# EAGLE design dual-radio (EAGLE 7.2.0)
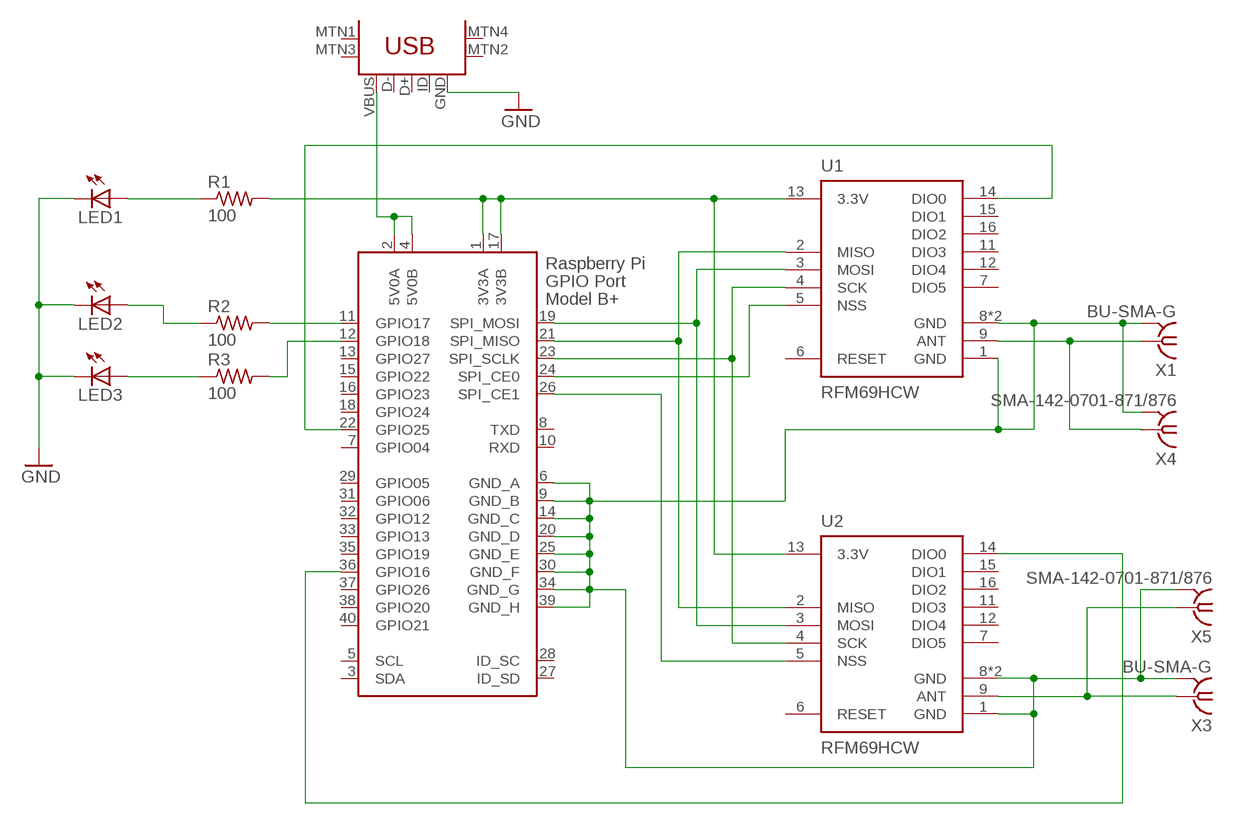
[diagram p0: schematic, sheet 1]

## Parts
LED1  LEDSML0805  [SML0805]
LED2  LEDSML0805  [SML0805]
LED3  LEDSML0805  [SML0805]
R1  100  R-US_M0805  [M0805]
R2  100  R-US_M0805  [M0805]
R3  100  R-US_M0805  [M0805]
U1  RFM69HCW  [RFM69HCW-XXXS2]
U2  RFM69HCW  [RFM69HCW-XXXS2]
U$1  USB-MINIB-5PIN  [USB-MINIB]
X1  BU-SMA-G  [BU-SMA-G]
X2  RASPI_BOARD_B+#_HDC  [RASPI_BOARD_B+HAT_DF_CF]
X3  BU-SMA-G  [BU-SMA-G]
X4  SMA-142-0701-871/876  [J502-ND-142-0701-871/876]
X5  SMA-142-0701-871/876  [J502-ND-142-0701-871/876]

## Nets
GND: LED1.C LED2.C LED3.C U$1.GND
N$1: R1.2 U1.13(3.3V) U2.13(3.3V) X2.1(3V3A) X2.17(3V3B)
N$2: U1.2(MISO) U2.2(MISO) X2.21(SPI_MISO)
N$3: U1.3(MOSI) U2.3(MOSI) X2.19(SPI_MOSI)
N$4: U1.4(SCK) U2.4(SCK) X2.23(SPI_SCLK)
N$5: U1.5(NSS) X2.24(SPI_CE0)
N$6: U2.5(NSS) X2.26(SPI_CE1)
N$7: U1.1(GND) U1.8(GND) U1.10(GND) U2.1(GND) U2.8(GND) U2.10(GND) X1.2 X1.3 X1.4 X1.5 X2.6(GND_A) X2.9(GND_B) X2.14(GND_C) X2.20(GND_D) X2.25(GND_E) X2.30(GND_F) X2.34(GND_G) X2.39(GND_H) X3.2 X3.3 X3.4 X3.5 X4.G@1 X4.G@2 X4.G@3 X4.G@4 X5.G@1 X5.G@2 X5.G@3 X5.G@4
N$8: U1.14(DIO0) X2.22(GPIO25)
N$9: U2.14(DIO0) X2.36(GPIO16)
N$10: U1.9(ANT) X1.1 X4.1
N$11: U2.9(ANT) X3.1 X5.1
N$12: R2.2 X2.11(GPIO17)
N$13: R3.2 X2.12(GPIO18)
N$14: LED1.A R1.1
N$15: LED2.A R2.1
N$16: LED3.A R3.1
N$17: U$1.VBUS X2.2(5V0A) X2.4(5V0B)
Unconnected: U1.6(RESET) U1.7(DIO5) U1.11(DIO3) U1.12(DIO4) U1.15(DIO1) U1.16(DIO2) U2.6(RESET) U2.7(DIO5) U2.11(DIO3) U2.12(DIO4) U2.15(DIO1) U2.16(DIO2) U$1.D+ U$1.D- U$1.ID U$1.MTN1(MTN2) U$1.MTN2(MTN3) U$1.MTN3(MTN1) U$1.MTN4 X2.3(SDA) X2.5(SCL) X2.7(GPIO04) X2.8(TXD) X2.10(RXD) X2.13(GPIO27) X2.15(GPIO22) X2.16(GPIO23) X2.18(GPIO24) X2.27(ID_SD) X2.28(ID_SC) X2.29(GPIO05) X2.31(GPIO06) X2.32(GPIO12) X2.33(GPIO13) X2.35(GPIO19) X2.37(GPIO26) X2.38(GPIO20) X2.40(GPIO21)

## Library data of the parts
LED1-LED3 = led:LED: LED OSRAM: - CHIPLED LG R971, LG N971, LY N971, LG Q971, LY Q971, LO R971, LY R971 LH N974, LH R974 LS Q976, LO Q976, LY Q976 LO Q996 - Hyper CHIPLED LW Q18S LB Q993, LB Q99A, LB R99A - SideLED LS A670, LO A670, LY A670, LG A670, LP A670 LB A673, LV A673, LT A673, LW A673 LH A674 LY A675 LS A676, LA A676, LO A676, LY A676, LW A676 LS A679, LY A679, LG A679 - Hyper Micro SIDELED® LS Y876, LA Y876, LO Y876, LY Y876 LT Y87S - SmartLED LW L88C, LW L88S LB L89C, LB L89S, LG L890 LS L89K, LO L89K, LY L89K LS L896, LA L896, LO L896, LY L896 - TOPLED LS T670, LO T670, LY T670, LG T670, LP T670 LSG T670, LSP T670, LSY T670, LOP T670, LYG T670 LG T671, LOG T671, LSG T671 LB T673, LV T673, LT T673, LW T673 LH T674 LS T676, LA T676, LO T676, LY T676, LB T676, LH T676, LSB T676, LW T676 LB T67C, LV T67C, LT T67C, LS T67K, LO T67K, LY T67K, LW E67C LS E67B, LA E67B, LO E67B, LY E67B, LB E67C, LV E67C, LT E67C LW T67C LS T679, LY T679, LG T679 LS T770, LO T770, LY T770, LG T770, LP T770 LB T773, LV T773, LT T773, LW T773 LH T774 LS E675, LA E675, LY E675, LS T675 LS T776, LA T776, LO T776, LY T776, LB T776 LHGB T686 LT T68C, LB T68C - Hyper Mini TOPLED® LB M676 - Mini TOPLED Santana® LG M470 LS M47K, LO M47K, LY M47K Source: http://www.osram.convergy.de LUXEON: - LUMILED® LXK2-PW12-R00, LXK2-PW12-S00, LXK2-PW14-U00, LXK2-PW14-V00 LXK2-PM12-R00, LXK2-PM12-S00, LXK2-PM14-U00 LXK2-PE12-Q00, LXK2-PE12-R00, LXK2-PE12-S00, LXK2-PE14-T00, LXK2-PE14-U00 LXK2-PB12-K00, LXK2-PB12-L00, LXK2-PB12-M00, LXK2-PB14-N00, LXK2-PB14-P00, LXK2-PB14-Q00 LXK2-PR12-L00, LXK2-PR12-M00, LXK2-PR14-Q00, LXK2-PR14-R00 LXK2-PD12-Q00, LXK2-PD12-R00, LXK2-PD12-S00 LXK2-PH12-R00, LXK2-PH12-S00 LXK2-PL12-P00, LXK2-PL12-Q00, LXK2-PL12-R00 Source: www.luxeon.com KINGBRIGHT: KA-3528ASYC Source: www.kingbright.com
R1-R3 = resistor:R-US_: RESISTOR, American symbol
U1 U2 = SparkFun-RF:RFM69H
U$1 = SparkFun-Connectors:USB-MINIB: Mini-USB "B" connector with 5th pin broken out. Created new symbol breaking out 5th "ID" pin in mini/micro USB connector spec. See: http://en.wikipedia.org/wiki/Mini_usb#Cables. Uses same footprint as 4-pin symbol. Also added pins to connect to mounting / shield pads if required (probably not generally needed as signals aren't shielded once they leave the connector).
X1 X3 = con-coax:BU-SMA-G: FEMALE SMA CONNECTOR Radiall distributor RS 193-9117; OC_FARNELL: unknown; OC_NEWARK: unknown
X2 = raspberrypi_bastelstube_v13:RASPI_BOARD_B+#: Raspberry Pi GPIO connector with markings for the outer dimensions of the Raspberry Pi board model B+ with different sets of drill holes or mounting pads All pins connected
X4 X5 = con-coax:SMA-: SMA 50 Ohm End Launch Jack Receptacle - Round Contact Johnson Components Source: www.johnsoncomponents.com .. J502-ND.pdf; MF: JOHNSON COMPONENTS; MPN: 142-0701-871; OC_FARNELL: 1339835; OC_NEWARK: 91B6105

## Board
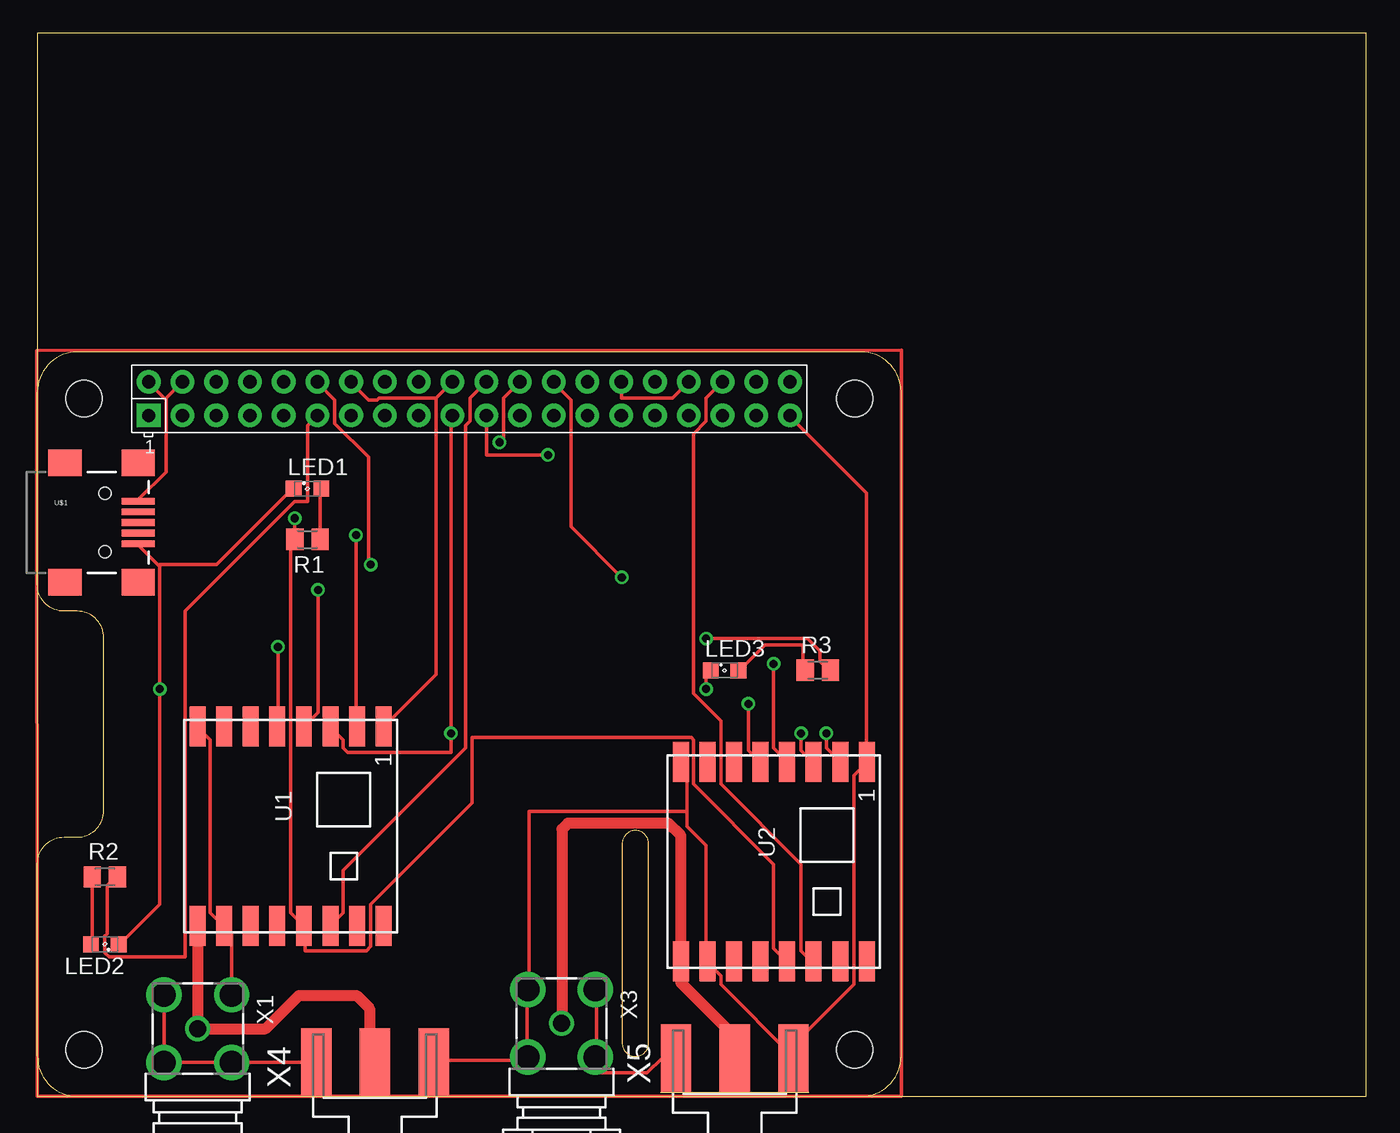
[diagram p1: board, top side]
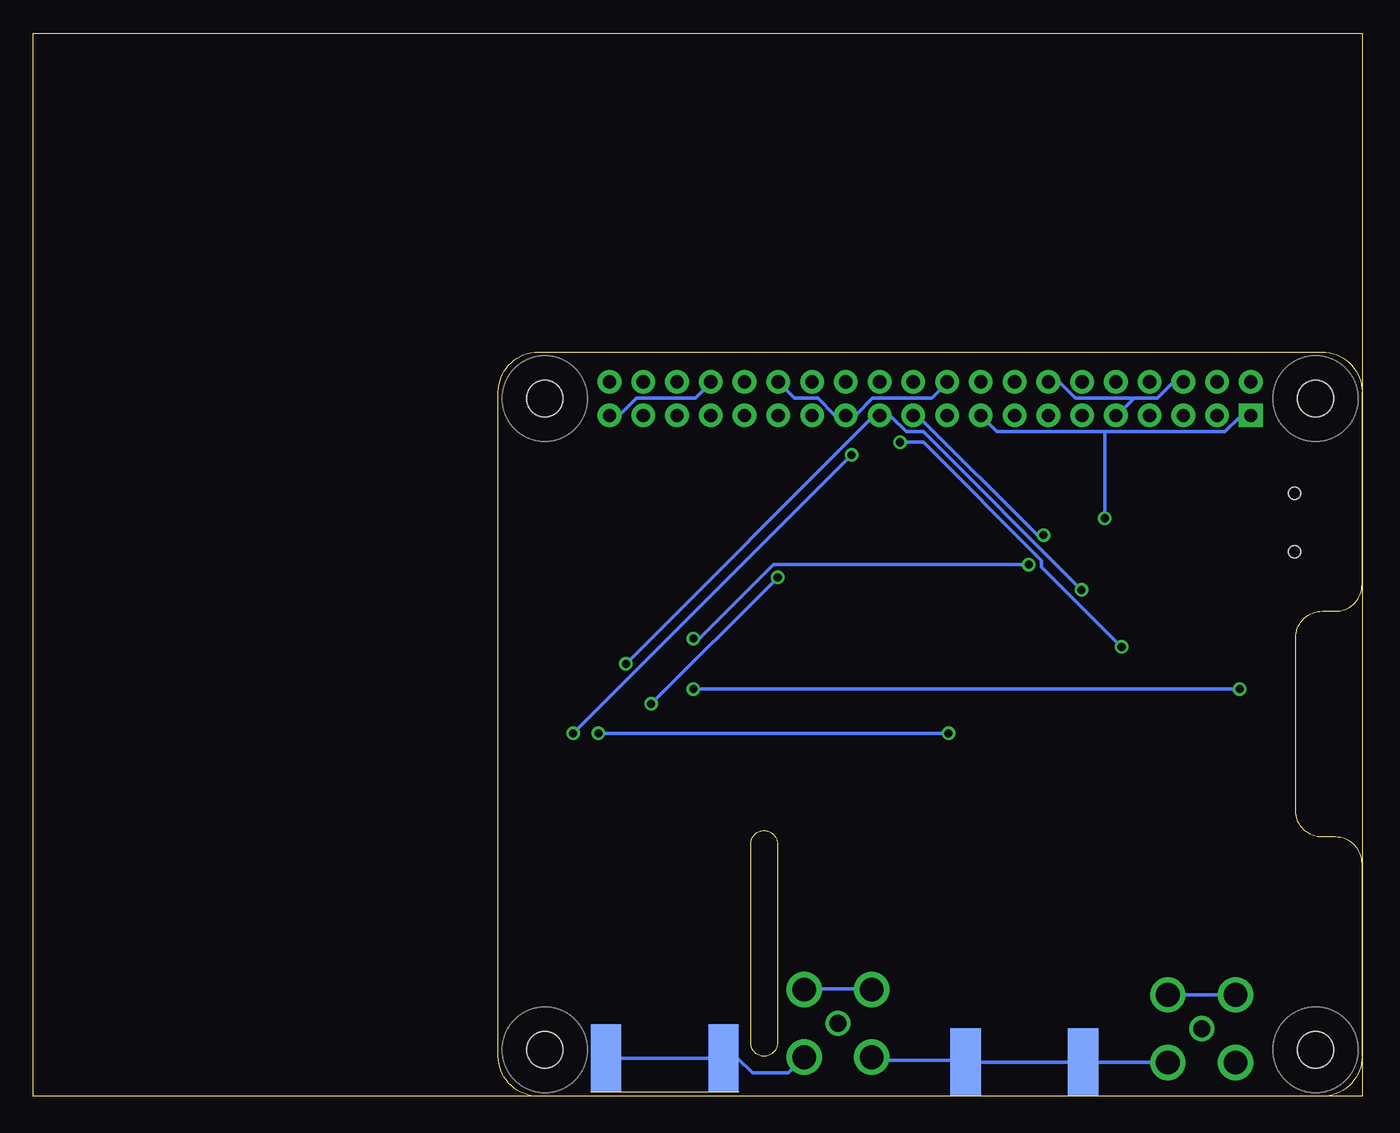
[diagram p2: board, bottom side, seen from below]

Size 100 x 80 mm. Coordinates in mm from the lower left corner, seen from the top.
Outline: 0,0 100,0 100,80 0,80 0,0
Copper layers (1*16): Top 0.035mm / dielectric 1.5mm / Bottom 0.035mm
Design rules "default": minimum track width 10mil, minimum drill 24mil, track to track 8mil, track to pad 8mil, pad to pad 8mil, via to via 8mil, smd to smd 8mil, copper to edge 40mil, drill to drill 8mil, minimum pad ring 10mil, minimum via ring 8mil, stop-mask expansion 4mil, vias tented up to drill 0mil, thermal gap 10mil

### Footprints (pad centres in the part's own frame; a part is rotated, then mirrored left to right if it is on the bottom)
SML0805 = smd 1.2 x 1.2: A 1.05,0; C -1.05,0
M0805 = smd 1.3 x 1.6: 1 -0.95,0; 2 0.95,0
RFM69HCW-XXXS2 = smd 3 x 1.2: 1 -7.5,7; 2 -7.5,5; 3 -7.5,3; 4 -7.5,1; 5 -7.5,-1; 6 -7.5,-3; 7 -7.5,-5; 8 -7.5,-7; 9 7.5,-7; 10 7.5,-5; 11 7.5,-3; 12 7.5,-1; 13 7.5,1; 14 7.5,3; 15 7.5,5; 16 7.5,7
USB-MINIB = smd 2.5 x 0.5: D+ 2.5,0; D- 2.5,0.8; GND 2.5,-1.6; ID 2.5,-0.8; VBUS 2.5,1.6 | smd 2.5 x 2: MTN1 -3,4.5; MTN2 2.5,4.5; MTN3 -3,-4.5; MTN4 2.5,-4.5 | hole 0.9: 0,2.2; 0,-2.2
BU-SMA-G = drill 1.27: 1 0,0 | drill 1.778: 2 -2.55,2.55; 3 2.55,2.55; 4 2.55,-2.55; 5 -2.55,-2.55
RASPI_BOARD_B+HAT_DF_CF = drill 1 pad 1.778 square: 1 8.37,51.23 | drill 1 pad 1.778: 2 8.37,53.77; 3 10.91,51.23; 4 10.91,53.77; 5 13.45,51.23; 6 13.45,53.77; 7 15.99,51.23; 8 15.99,53.77; 9 18.53,51.23; 10 18.53,53.77; 11 21.07,51.23; 12 21.07,53.77; 13 23.61,51.23; 14 23.61,53.77; 15 26.15,51.23; 16 26.15,53.77; 17 28.69,51.23; 18 28.69,53.77; 19 31.23,51.23; 20 31.23,53.77; 21 33.77,51.23; 22 33.77,53.77; 23 36.31,51.23; 24 36.31,53.77; 25 38.85,51.23; 26 38.85,53.77; 27 41.39,51.23; 28 41.39,53.77; 29 43.93,51.23; 30 43.93,53.77; 31 46.47,51.23; 32 46.47,53.77; 33 49.01,51.23; 34 49.01,53.77; 35 51.55,51.23; 36 51.55,53.77; 37 54.09,51.23; 38 54.09,53.77; 39 56.63,51.23; 40 56.63,53.77 | hole 2.75: 3.5,3.5; 3.5,52.5; 61.5,3.5; 61.5,52.5
J502-ND-142-0701-871/876 = smd 5.08 x 2.286: 1 2.565,0; G@1 2.565,4.42; G@2 2.565,-4.42 | smd 5.08 x 2.286 bottom: G@3 2.565,4.42; G@4 2.565,-4.42

### Placement (x,y rotation side)
LED1  20.32,45.72 0 top
LED2  5.08,11.43 180 top
LED3  51.72,32.05 0 top
R1  20.32,41.91 180 top
R2  5.08,16.51 0 top
R3  58.73,32.05 0 top
U1  19.05,20.32 270 top
U2  55.42,17.64 270 top
U$1  5.08,43.18 0 top
X1  12.06,5.08 270 top
X2  0,0 0 top
X3  39.44,5.48 270 top
X4  25.4,0 90 top
X5  52.48,0.3 90 top

### Tracks (layer width: path | path; a pad name or v marks a point on that pad's centre or on a via)
GND  (via drill 0.61)
  Top 0.254: 9.13,39.93 7.62,41.43 U$1.GND | 9.13,39.93 9.21,39.85 v9.21,30.64 9.21,14.45 6.19,11.43 LED2.C | LED1.C 19.21,45.72 13.49,40.01 9.21,40.01 9.13,39.93 | v50.32,30.64 50.32,31.59 50.64,31.91 LED3.C
  Bottom 0.254: v9.21,30.64 v50.32,30.64
N$1  (via drill 0.61)
  Top 0.254: R1.2 19.05,41.59 19.05,13.81 20,12.86 U1.13 20.16,12.7 20.16,10.95 24.77,10.95 25.08,11.27 25.08,14.45 32.7,22.07 32.7,26.99 49.21,26.99 49.37,26.83 49.37,23.5 55.4,17.46 55.4,11.11 56.36,10.16 U2.13 | R1.2 v19.37,43.5 | R1.2
  Bottom 0.254: 19.37,50.01 27.46,50.01 28.57,51.12 X2.17 | 19.37,50.01 10.32,50.01 9.21,51.12 8.41,51.12 X2.1 | v19.37,43.5 19.37,50.01
N$2  (via drill 0.61)
  Top 0.254: v23.97,42.23 23.97,27.94 U1.2 | v59.37,27.3 59.37,26.19 60.33,25.24 U2.2 | v38.42,48.26 33.81,48.26 33.81,51.12 X2.21
  Bottom 0.254: v23.97,42.23 24.45,42.23 33.34,51.12 33.66,51.12 X2.21 | v38.42,48.26 v59.37,27.3
N$3  (via drill 0.61)
  Top 0.254: U1.3 22.07,27.78 23.02,26.83 23.02,26.19 23.34,25.88 31.11,25.88 v31.11,27.3 31.11,51.12 X2.19 | v57.47,27.3 57.47,26.04 58.26,25.24 U2.3
  Bottom 0.254: v31.11,27.3 v57.47,27.3
N$4  (via drill 0.61)
  Top 0.254: v21.11,38.1 21.11,28.89 20.16,27.94 U1.4 | v55.4,32.54 55.4,26.19 56.36,25.24 U2.4
  Bottom 0.254: v21.11,38.1 33.02,50.01 34.29,50.01 35.4,51.12 36.2,51.12 X2.23 36.35,51.12 36.83,51.12 v55.4,32.54
N$5  (via drill 0.61)
  Top 0.254: v18.1,33.81 18.1,27.94 U1.5 | v34.77,49.21 35.08,49.53 35.08,52.55 36.2,53.66 X2.24
  Bottom 0.254: v18.1,33.81 24.13,39.85 24.13,40.32 33.02,49.21 v34.77,49.21
N$6  (via drill 0.61)
  Top 0.254: v53.5,29.53 53.5,26.04 54.29,25.24 U2.5 | v43.97,39.05 40.16,42.86 40.16,52.39 38.89,53.66 X2.26
  Bottom 0.254: v43.97,39.05 v53.5,29.53
N$7
  Top 0.254: X2.34 48.9,53.66 47.78,52.55 43.97,52.55 43.97,53.66 X2.30 | 30,52.55 30,31.75 26.19,27.94 U1.1 | 30,52.55 31.11,53.66 X2.20 | 30,52.55 25.72,52.55 25.56,52.39 24.92,52.39 23.65,53.66 X2.14 | X1.2 14.61,7.78 14.61,12.22 14.13,12.7 U1.10 13.97,12.86 13.02,13.81 13.02,26.83 12.06,27.78 U1.8 | X1.4 X1.5 | X4.G@1 20.95,2.54 14.76,2.54 X1.3 X1.4 | X1.4 | 48.9,21.43 48.9,20.32 50.32,18.89 50.32,10.16 U2.10 50.48,10 51.44,9.05 51.44,8.41 56.83,3.02 X5.G@2 56.52,3.49 61.44,8.41 61.44,24.13 62.39,25.08 U2.1 62.39,25.24 62.39,45.4 56.67,51.12 X2.39 | 48.9,21.43 48.9,24.61 48.42,25.08 U2.8 | X5.G@1 47.94,2.86 46.99,2.86 45.88,1.75 42.07,1.75 42.07,2.86 X3.3 42.07,3.02 42.07,7.94 X3.2 | X4.G@2 29.84,2.7 36.83,2.7 36.83,2.86 X3.4 36.83,3.02 36.83,7.94 X3.5 36.99,8.1 36.99,21.43 48.9,21.43
  Bottom 0.254: X2.30 43.81,53.66 42.7,52.55 40.96,52.55 39.69,51.28 38.89,51.28 X2.25 38.73,51.28 38.1,51.28 36.83,52.55 32.38,52.55 31.27,53.66 X2.20 | X2.39 56.52,51.28 55.88,51.28 54.61,52.55 50.16,52.55 49.05,53.66 X2.34 | 17.22,52.47 18.41,51.28 X2.9 | 17.22,52.47 17.14,52.55 15.4,52.55 14.29,53.66 13.49,53.66 X2.6 | X2.14 23.5,53.66 22.7,53.66 21.59,52.55 17.3,52.55 17.22,52.47 | X1.3 14.76,2.54 20.95,2.54 X4.G@1 21.11,2.54 29.69,2.54 X4.G@2 29.84,2.7 36.67,2.7 36.83,2.86 X3.4 | X1.2 X1.5 | X5.G@2 56.83,2.86 48.1,2.86 X5.G@1 47.94,2.86 46.99,2.86 45.88,1.75 43.18,1.75 42.07,2.86 X3.3 | X3.5 36.99,8.1 41.91,8.1 X3.2
N$8
  Top 0.254: U1.14 22.07,12.86 23.02,13.81 23.02,16.99 32.23,26.19 32.23,50.48 32.54,50.8 32.54,52.55 33.66,53.66 X2.22
N$9
  Top 0.254: U2.14 58.26,10.16 57.47,10.95 57.47,17.46 51.44,23.5 51.44,28.26 49.37,30.32 49.37,49.85 50.32,50.8 50.32,52.55 51.44,53.66 X2.36
N$10
  Top 0.813: U1.9 12.05,5.09 X1.1 17.19,5.08 19.69,7.58 24.01,7.58 24.99,6.6 24.99,2.97 X4.1
N$11
  Top 0.813: X5.1 52.72,3.1 52.72,4.25 48.41,8.55 U2.9 48.41,19.62 47.49,20.55 39.91,20.55 39.46,20.09 39.46,5.5 X3.1
N$12
  Top 0.254: R2.2 5.87,16.51 5.24,15.88 5.24,12.22 5.08,12.06 5.08,10.79 5.4,10.48 11.11,10.48 11.11,36.51 19.37,44.77 20.32,44.77 20.32,50.48 20.95,51.12 X2.11
N$13  (via drill 0.61)
  Top 0.254: v50.32,34.45 57.94,34.45 58.9,33.5 58.9,32.7 59.53,32.07 R3.2 | v25.08,40.01 24.92,40.16 24.92,48.1 22.38,50.64 22.38,52.39 21.11,53.66 X2.12
  Bottom 0.254: v50.32,34.45 49.85,34.45 44.29,40.01 v25.08,40.01
N$14
  Top 0.254: LED1.A 21.27,45.72 R1.1
N$15
  Top 0.254: LED2.A 4.13,11.43 R2.1
N$16
  Top 0.254: LED3.A 52.86,32.07 54.77,33.97 57.63,33.97 57.63,32.07 R3.1
N$17
  Top 0.254: 9.68,52.39 9.68,52.55 10.79,53.66 X2.4 | 9.68,52.39 9.68,46.99 7.62,44.93 U$1.VBUS | 9.68,52.39 8.41,53.66 X2.2
N$18
  Top 0.254: -0.06,56.13 65.02,56.16 65.02,0.01 0,0 -0.06,56.13